# EAGLE schematic FRA_daughter_v1 (EAGLE 7.6.0)
Assembly variants: ESP8266 CH340 default

## Sheet 1 of 3
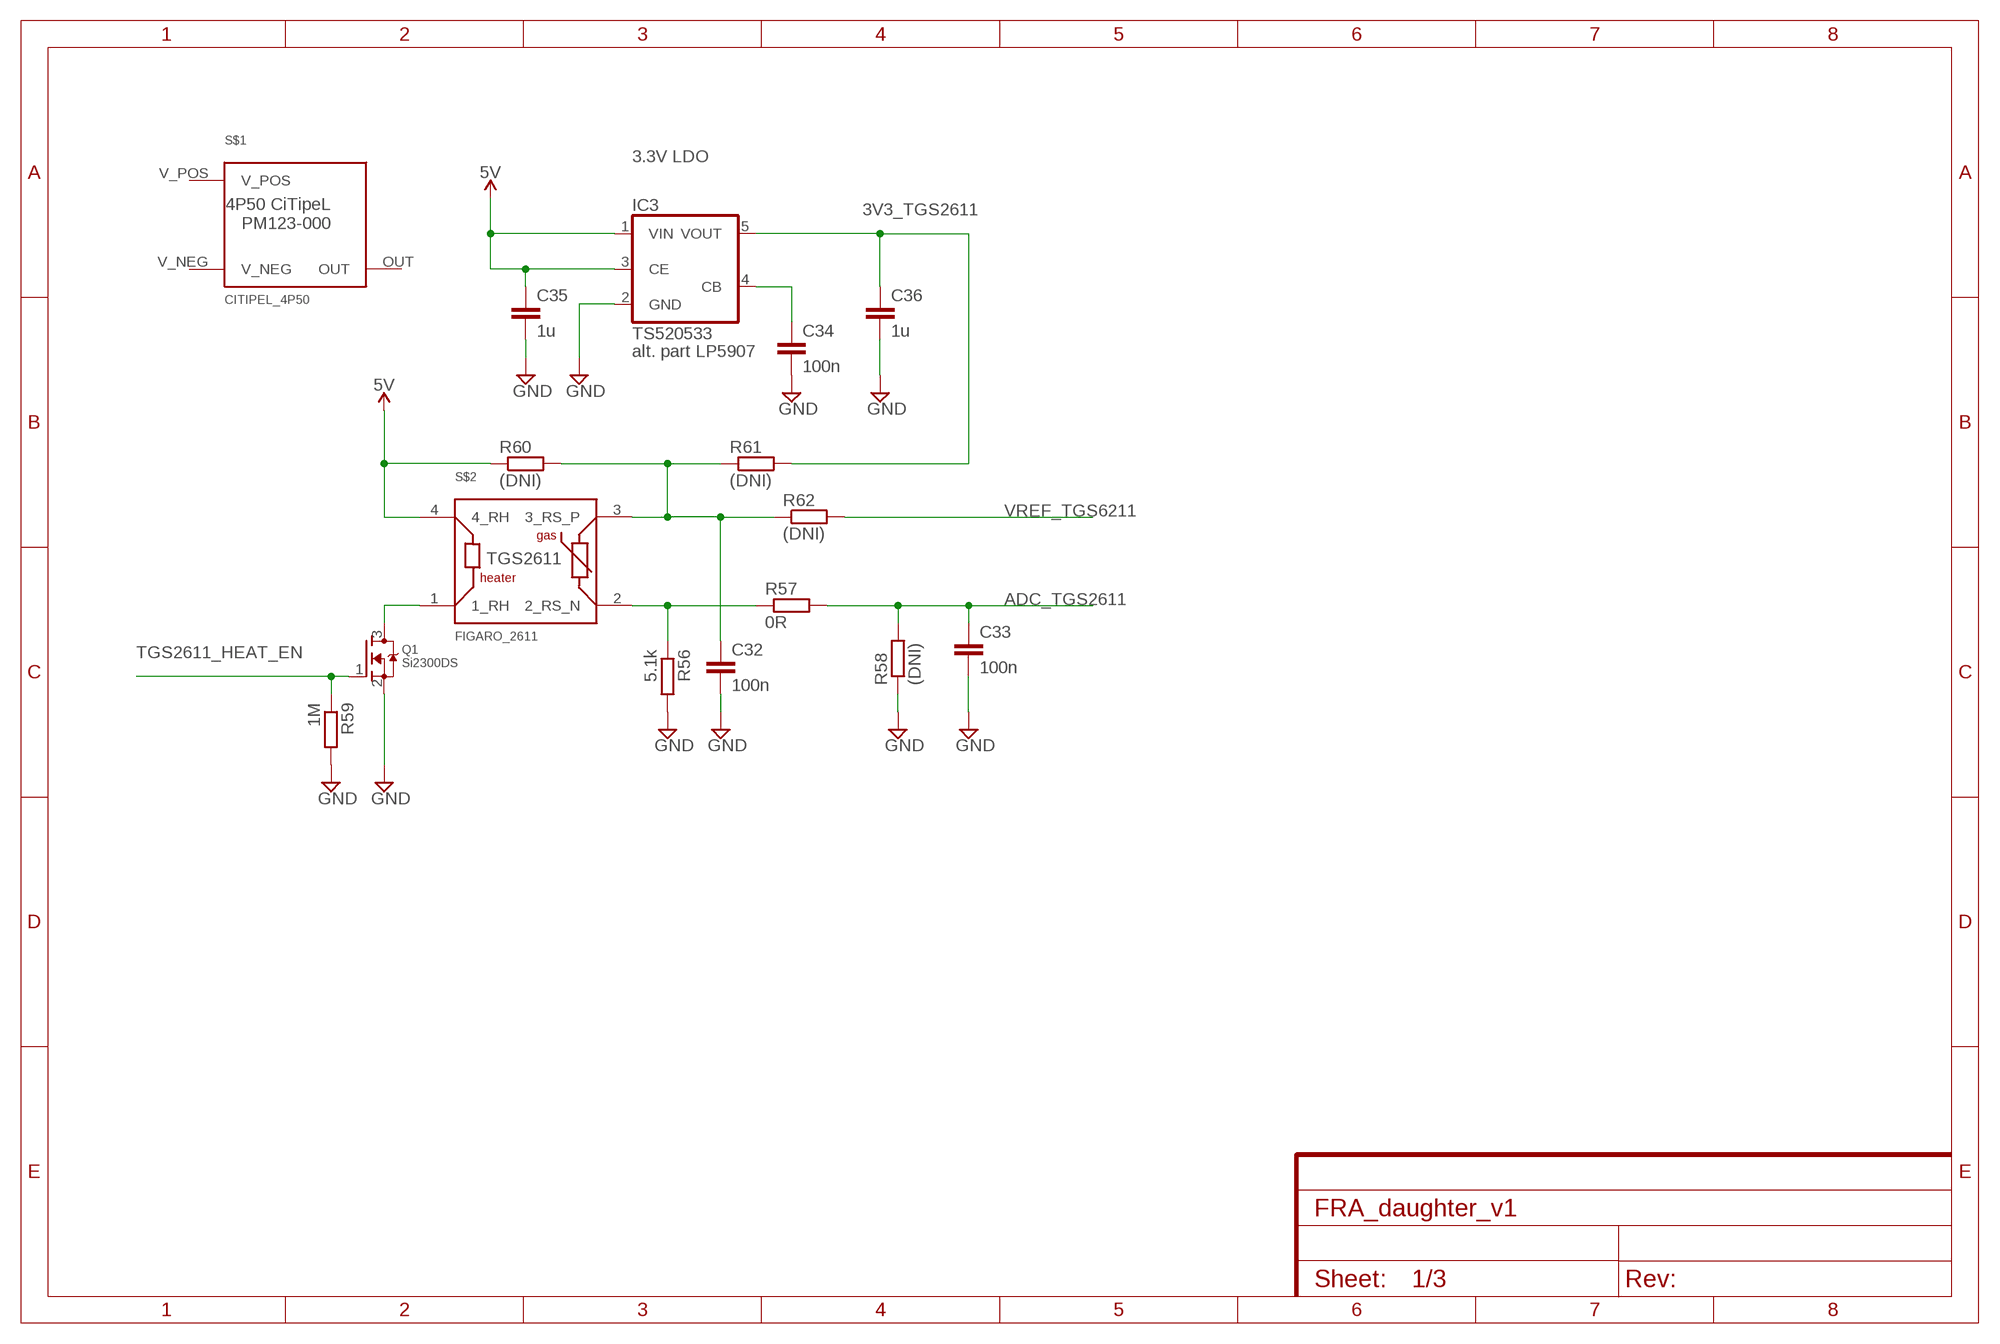
[diagram p0: schematic, sheet 1]

### Parts
C32  100n  C-EUC0603K  [C0603K]
C33  100n  C-EUC0603K  [C0603K]
C34  100n  C-EUC0603K  [C0603K]
C35  1u  C-EUC0603K  [C0603K]
C36  1u  C-EUC0603K  [C0603K]
IC3  TS520533  [SOT25]
Q1  Si2300DS  MOSFET-NREFLOW  [SOT23]
R56  5.1k  R-EU_R0603  [R0603]  (not fitted in variant ESP8266 CH340 default)
R57  0R  R-EU_R0603  [R0603]
R58  (DNI)  R-EU_R0603  [R0603]
R59  1M  R-EU_R0603  [R0603]
R60  (DNI)  R-EU_R0603  [R0603]
R61  (DNI)  R-EU_R0603  [R0603]
R62  (DNI)  R-EU_R0603  [R0603]
S$1  CITIPEL_4P50  [TH3_4P50]
S$2  FIGARO_2611  [TH4_TGS2611]

### Nets
3V3_TGS2611: C36.1 IC3.5(VOUT) R61.2
5V: C35.1 IC3.1(VIN) IC3.3(CE) R60.1 S$2.4(4_RH)
ADC_TGS2611: C33.1 R57.2 R58.2
GND: C32.2 C33.2 C34.2 C35.2 C36.2 IC3.2(GND) Q1.2(S) R56.2 R58.1 R59.2 ; also sheet 3
N$53: Q1.3(D) S$2.1(1_RH)
N$56: C34.1 IC3.4(CB)
RS_NEG: R56.1 R57.1 S$2.2(2_RS_N)
RS_POS: C32.1 R60.2 R61.1 R62.1 S$2.3(3_RS_P)
TGS2611_HEAT_EN: Q1.1(G) R59.1
VREF_TGS6211: R62.2
Unconnected: S$1.OUT

### Notes on the sheet
- 3.3V LDO
- alt. part LP5907

## Sheet 2 of 3
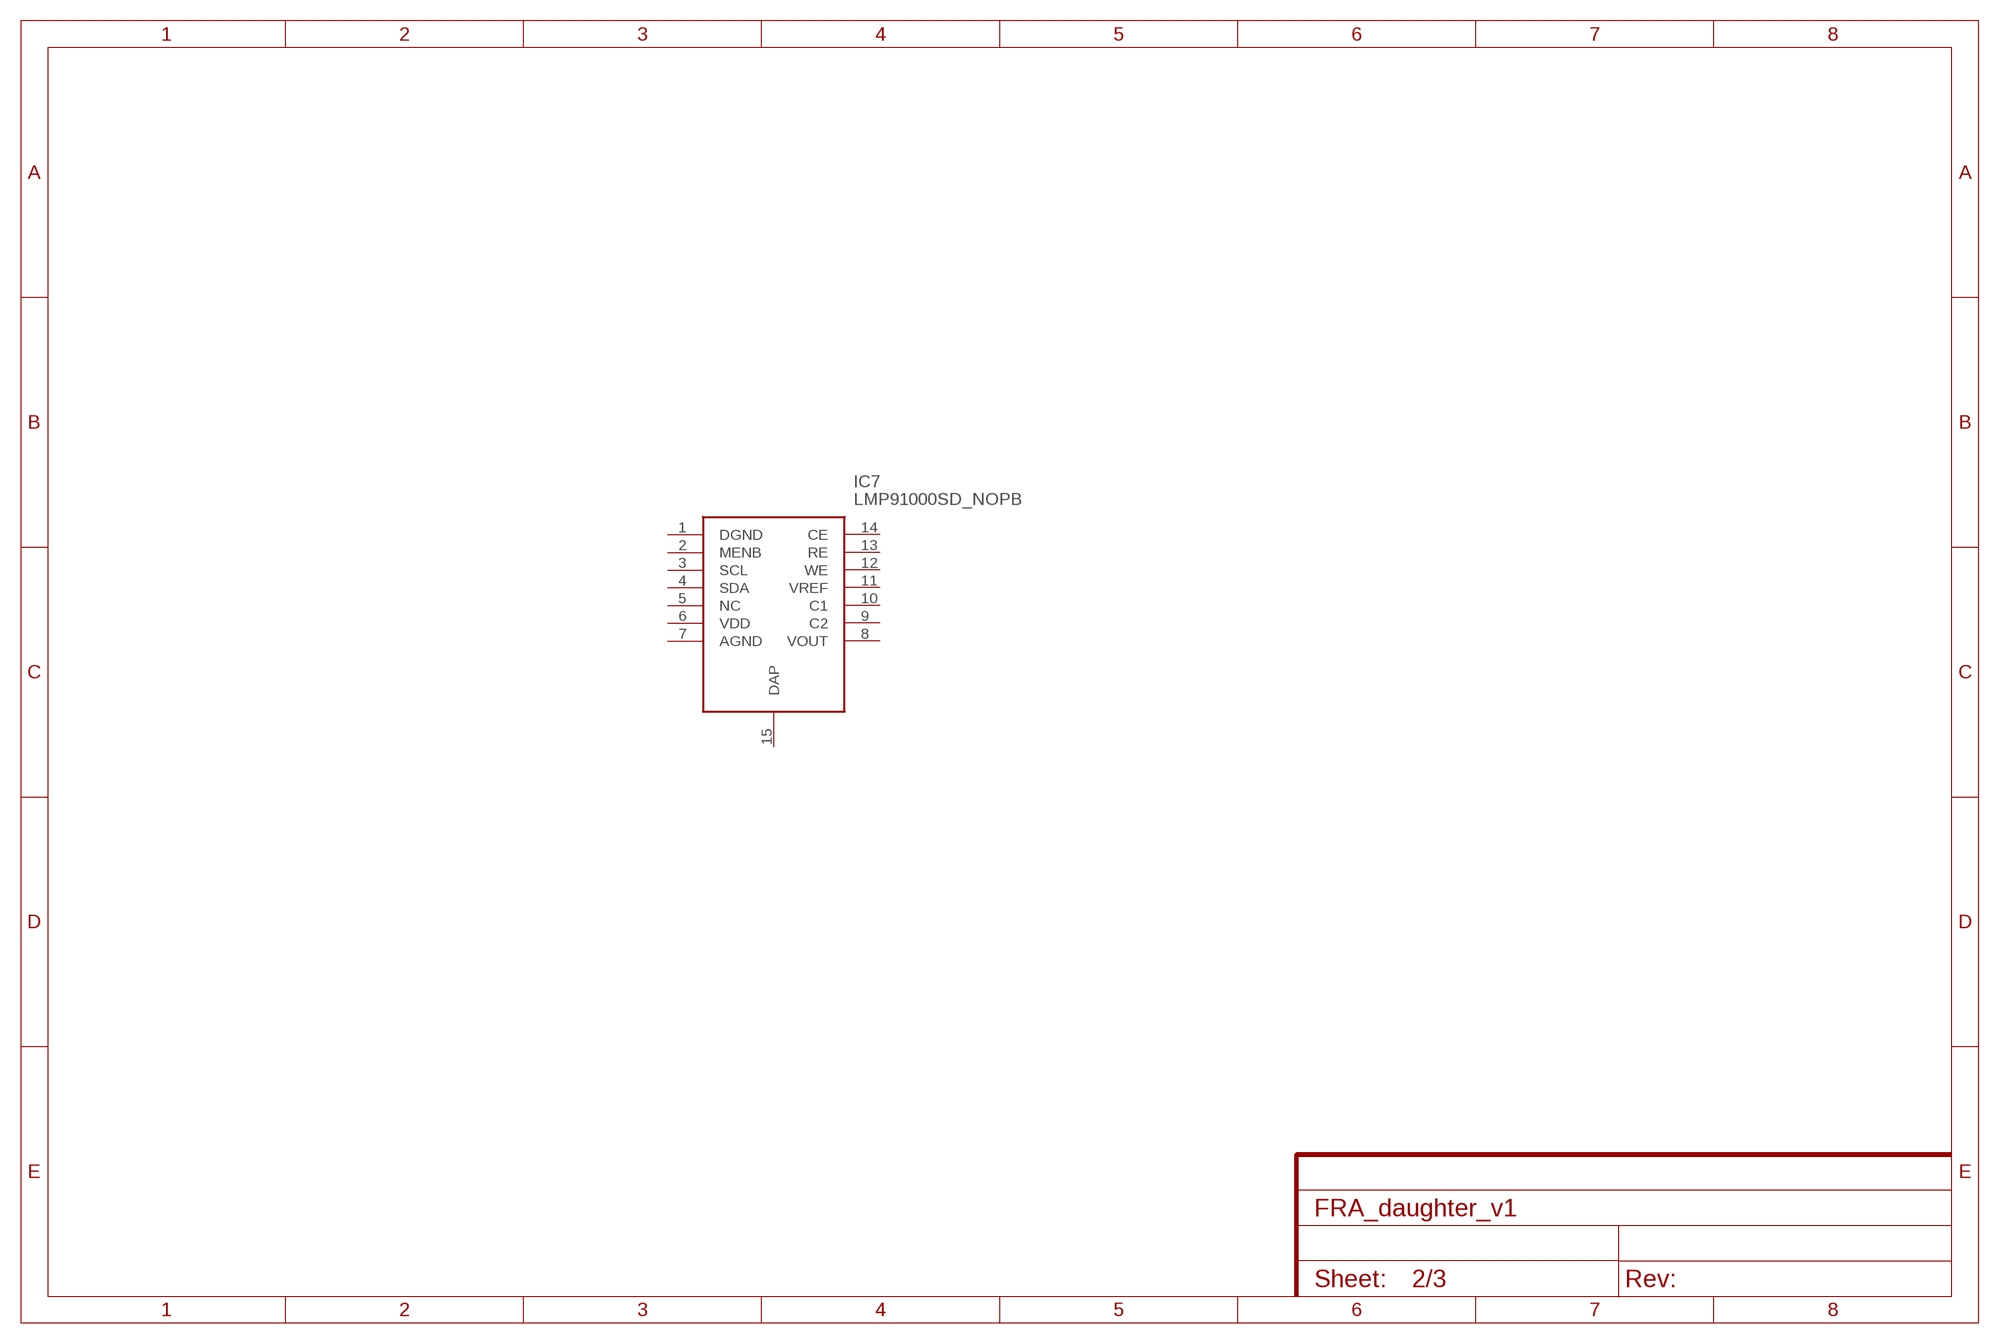
[diagram p1: schematic, sheet 2]

### Parts
IC7  LMP91000SD_NOPB  [SON50P400X400X80-15N]
Unconnected: IC7.2(MENB) IC7.3(SCL) IC7.4(SDA) IC7.5(NC) IC7.8(VOUT) IC7.9(C2) IC7.10(C1) IC7.11(VREF) IC7.12(WE) IC7.13(RE) IC7.14(CE)

## Sheet 3 of 3
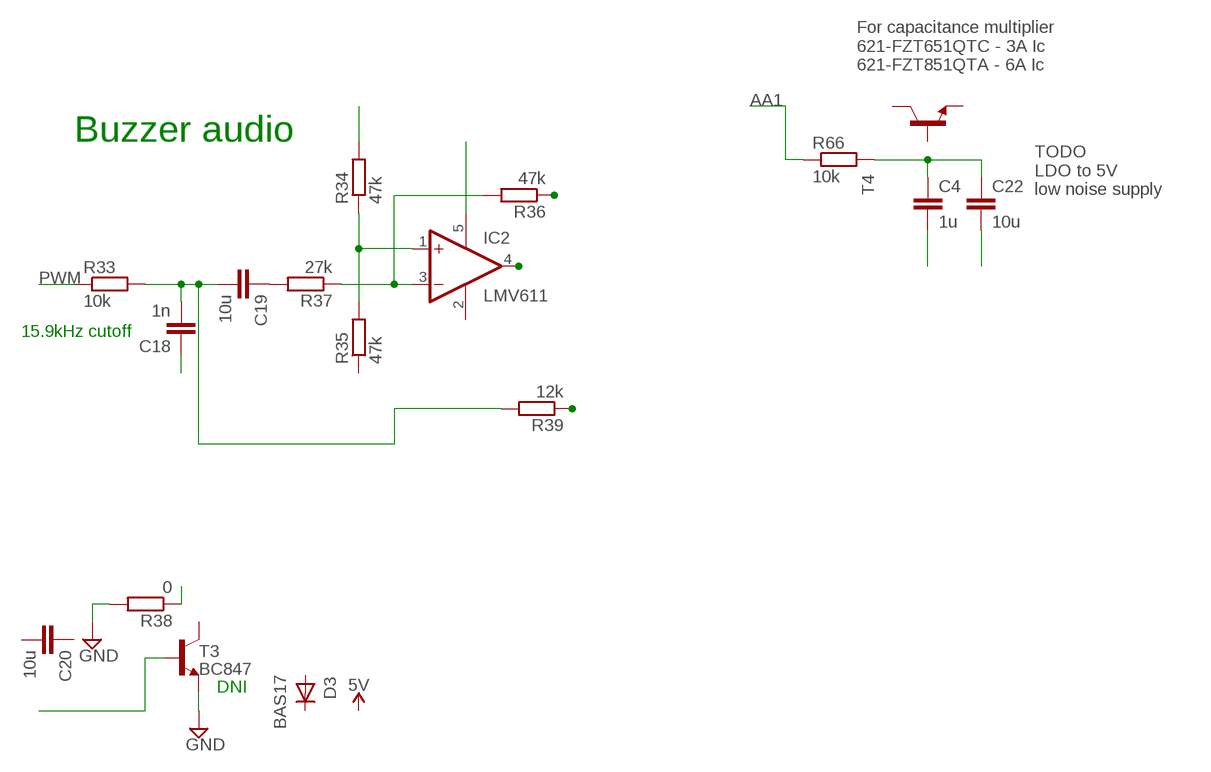
[diagram p2: schematic, sheet 3]

### Parts
C4  1u  C-EUC0603K  [C0603K]
C18  1n  C-EUC0603K  [C0603K]
C19  10u  C-EUC0603K  [C0603K]
C20  10u  C-EUC0603K  [C0603K]
C22  10u  C-EUC0603K  [C0603K]
D3  BAS17  [SOT23]
IC2  LMV611  OPA333DCK  [SC70-5L]
R33  10k  R-EU_R0603  [R0603]
R34  47k  R-EU_R0603  [R0603]
R35  47k  R-EU_R0603  [R0603]
R36  47k  R-EU_R0603  [R0603]
R37  27k  R-EU_R0603  [R0603]
R38  0  R-EU_R0603  [R0603]
R39  12k  R-EU_R0603  [R0603]  (not fitted in variant ESP8266 CH340 default)
R66  10k  R-EU_R0603  [R0603]
T3  BC847  [SOT23]  (not fitted in variant ESP8266 CH340 default)
T4  -NPN-SOT223  [SOT223]

### Nets
AA1: R66.1
GND: R38.2 T3.2(E) ; also sheet 1
N$12: C4.1 C22.1 R66.2
N$13: C22.2
N$14: C4.2
N$16: IC2.5(V+)
N$17: R38.1
N$18: R34.2
N$26: R39.1 T3.1(B)
N$27: C18.1
N$28: IC2.1(+IN) R34.1 R35.2
N$32: IC2.3(-IN) R36.2 R37.1
N$34: C19.1 R37.2
N$35: IC2.4(OUT) R36.1
N$36: C18.2 C19.2 R33.2 R39.2
PWM: R33.1
Unconnected: C20.1 C20.2 D3.1(A) D3.3(K) R35.1 T3.3(C) T4.1(B) T4.3(E) T4.4(C)

### Notes on the sheet
- For capacitance multiplier
  621-FZT651QTC - 3A Ic
  621-FZT851QTA - 6A Ic
- Buzzer audio
- TODO 
  LDO to 5V
  low noise supply
- 15.9kHz cutoff
- DNI

## Power pins joined to a net without a drawn wire
AGND: IC7.7(AGND)
DAP: IC7.15(DAP)
DGND: IC7.1(DGND)
V-: IC2.2(V-)
V_NEG: S$1.V_NEG
V_POS: S$1.V_POS
VDD: IC7.6(VDD)

## Library data of the parts
C4 C18-C20 C22 C32-C36 = resistor:C-EU: CAPACITOR, European symbol
D3 = nxp_60:BAS17: Low-voltage stabistor Low-voltage stabilization diode in a small SOT23 plastic package. AAL Eindhoven MK
IC2 = linear:OPA333: 1.8V, microPOWER CMOS OPERATIONAL AMPLIFIERS Zerø-Drift Series Source: Texas Instruments (Burr-Brown) .. U11 opa333 Operational Amp.pdf
IC3 = v-reg:TS5205: 150mA Low Noise LDO Voltage Regulator with Enable TSC [Taiwan Semiconductor Company, Ltd] Source: http://www.taiwansemi.com .. 5205_0409c.pdf
IC7 = SamacSys_Parts:LMP91000SD_NOPB: Configurable AFE Potentiostat for Low-Power Chemical Sensing Applications Source: Datasheet <http://www.ti.com/lit/ds/symlink/lmp91000.pdf>; DESCRIPTION: Configurable AFE Potentiostat for Low-Power Chemical Sensing Applications; HEIGHT: 0.8mm; MANUFACTURER_NAME: Texas Instruments; MANUFACTURER_PART_NUMBER: LMP91000SD/NOPB; MOUSER_PART_NUMBER: 926-LMP91000SD/NOPB; MOUSER_PRICE-STOCK: https://www.mouser.com/Search/Refine.aspx?Keyword=926-LMP91000SD%2FNOPB
Q1 = adafruit:MOSFET-N: N-Channel Mosfet 2N7002E - 60V 260mA SOT23 [Digikey: 2N7002ET1GOSTR-ND] - REEL BSH103 - 30V 850mA SOT23 [Digikey: 568-5013-1-ND]
R33-R39 R56-R62 R66 = resistor:R-EU_: RESISTOR, European symbol
S$1 = FRA_eagle_lib:CITIPEL_4P50: Combustible gas sensor CiTiPeL 4P50 datasheet <https://www.citytech.com.cn/pdf-datasheets/4p50.pdf> Operating Voltage: 4.25V +- 0.02 VDC Operating current 56+- 6 mA Sensitivity 37mV +- 7mV/%methane
S$2 = FRA_eagle_lib:FIGARO_2611: Combustible gas sensor Figaro TGS2611 Figaro TGS2611 datasheet <https://www.figaro.co.jp/en/product/docs/tgs2611_product_information_rev02.pdf> Heater and Cicuit Voltage: 5V +- 0.2 VDC
T3 = nxp_60:BC847: 45 V, 100 mA NPN general-purpose transistors NPN general-purpose transistor AAL Eindhoven MK
T4 = transistor-neu-to92:*-NPN-: NPN Transistror